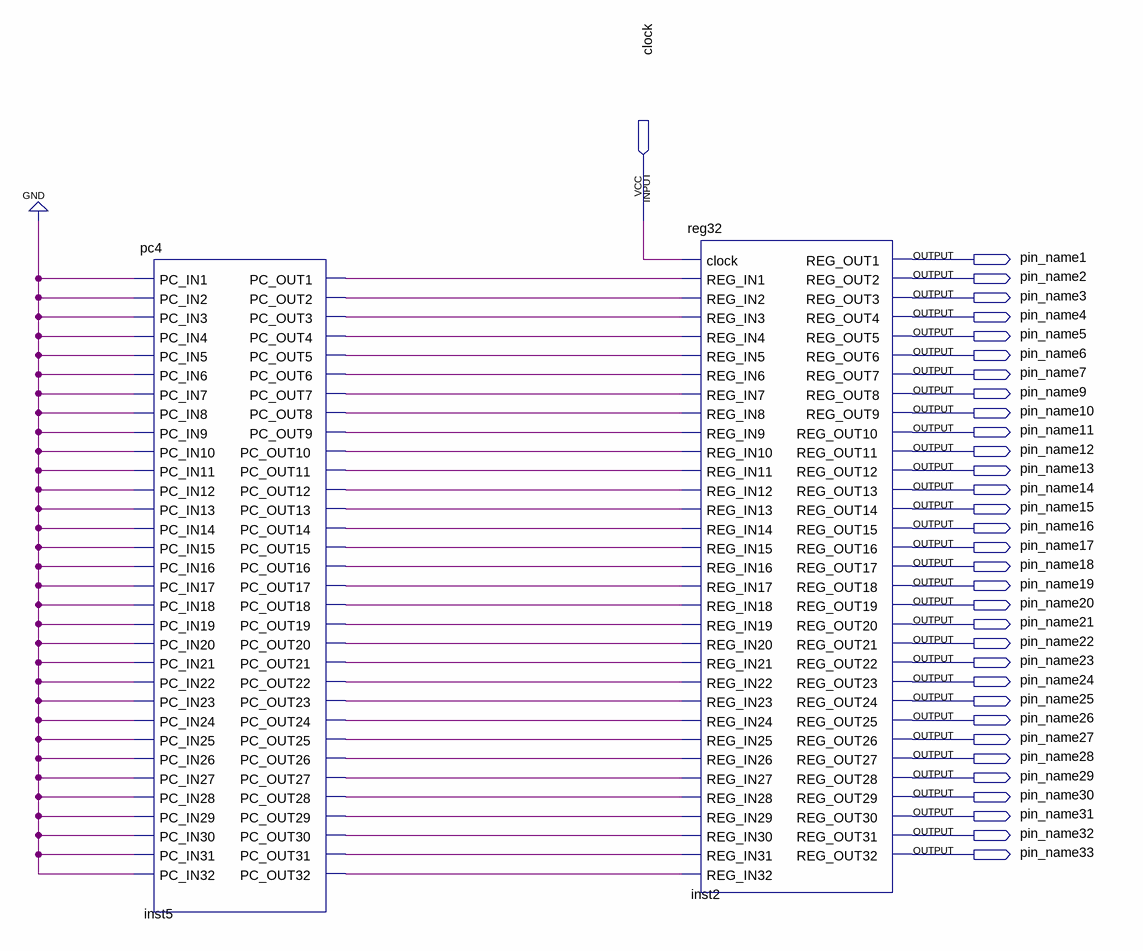
[diagram p0: schematic sheet]
// Quartus schematic Trabalho2.bdf as structural Verilog: 2 symbols, 33 pins
module Trabalho2 (
  input  clock,
  output pin_name1,
  output pin_name2,
  output pin_name3,
  output pin_name4,
  output pin_name5,
  output pin_name6,
  output pin_name7,
  output pin_name9,
  output pin_name10,
  output pin_name11,
  output pin_name12,
  output pin_name13,
  output pin_name14,
  output pin_name15,
  output pin_name16,
  output pin_name17,
  output pin_name18,
  output pin_name19,
  output pin_name20,
  output pin_name21,
  output pin_name22,
  output pin_name23,
  output pin_name24,
  output pin_name25,
  output pin_name26,
  output pin_name27,
  output pin_name28,
  output pin_name29,
  output pin_name30,
  output pin_name31,
  output pin_name32,
  output pin_name33
);

  wire inst5_pc_out1, inst5_pc_out2, inst5_pc_out3, inst5_pc_out4, inst5_pc_out5, inst5_pc_out6,
       inst5_pc_out7, inst5_pc_out8, inst5_pc_out9, inst5_pc_out10, inst5_pc_out11, inst5_pc_out12,
       inst5_pc_out13, inst5_pc_out14, inst5_pc_out15, inst5_pc_out16, inst5_pc_out17, inst5_pc_out18,
       inst5_pc_out19, inst5_pc_out20, inst5_pc_out21, inst5_pc_out22, inst5_pc_out23, inst5_pc_out24,
       inst5_pc_out25, inst5_pc_out26, inst5_pc_out27, inst5_pc_out28, inst5_pc_out29, inst5_pc_out30,
       inst5_pc_out31, inst5_pc_out32;

  pc4 inst5 (
    .PC_IN1(1'b0), .PC_IN2(1'b0), .PC_IN3(1'b0), .PC_IN4(1'b0), .PC_IN5(1'b0), .PC_IN6(1'b0), .PC_IN7(1'b0),
    .PC_IN8(1'b0), .PC_IN9(1'b0), .PC_IN10(1'b0), .PC_IN11(1'b0), .PC_IN12(1'b0), .PC_IN13(1'b0),
    .PC_IN14(1'b0), .PC_IN15(1'b0), .PC_IN16(1'b0), .PC_IN17(1'b0), .PC_IN18(1'b0), .PC_IN19(1'b0),
    .PC_IN20(1'b0), .PC_IN21(1'b0), .PC_IN22(1'b0), .PC_IN23(1'b0), .PC_IN24(1'b0), .PC_IN25(1'b0),
    .PC_IN26(1'b0), .PC_IN27(1'b0), .PC_IN28(1'b0), .PC_IN29(1'b0), .PC_IN30(1'b0), .PC_IN31(1'b0),
    .PC_IN32(1'b0), .PC_OUT1(inst5_pc_out1), .PC_OUT2(inst5_pc_out2), .PC_OUT3(inst5_pc_out3),
    .PC_OUT4(inst5_pc_out4), .PC_OUT5(inst5_pc_out5), .PC_OUT6(inst5_pc_out6), .PC_OUT7(inst5_pc_out7),
    .PC_OUT8(inst5_pc_out8), .PC_OUT9(inst5_pc_out9), .PC_OUT10(inst5_pc_out10), .PC_OUT11(inst5_pc_out11),
    .PC_OUT12(inst5_pc_out12), .PC_OUT13(inst5_pc_out13), .PC_OUT14(inst5_pc_out14),
    .PC_OUT15(inst5_pc_out15), .PC_OUT16(inst5_pc_out16), .PC_OUT17(inst5_pc_out17),
    .PC_OUT18(inst5_pc_out18), .PC_OUT19(inst5_pc_out19), .PC_OUT20(inst5_pc_out20),
    .PC_OUT21(inst5_pc_out21), .PC_OUT22(inst5_pc_out22), .PC_OUT23(inst5_pc_out23),
    .PC_OUT24(inst5_pc_out24), .PC_OUT25(inst5_pc_out25), .PC_OUT26(inst5_pc_out26),
    .PC_OUT27(inst5_pc_out27), .PC_OUT28(inst5_pc_out28), .PC_OUT29(inst5_pc_out29),
    .PC_OUT30(inst5_pc_out30), .PC_OUT31(inst5_pc_out31), .PC_OUT32(inst5_pc_out32));
  reg32 inst2 (
    .clock(clock), .REG_IN1(inst5_pc_out1), .REG_IN2(inst5_pc_out2), .REG_IN3(inst5_pc_out3),
    .REG_IN4(inst5_pc_out4), .REG_IN5(inst5_pc_out5), .REG_IN6(inst5_pc_out6), .REG_IN7(inst5_pc_out7),
    .REG_IN8(inst5_pc_out8), .REG_IN9(inst5_pc_out9), .REG_IN10(inst5_pc_out10), .REG_IN11(inst5_pc_out11),
    .REG_IN12(inst5_pc_out12), .REG_IN13(inst5_pc_out13), .REG_IN14(inst5_pc_out14),
    .REG_IN15(inst5_pc_out15), .REG_IN16(inst5_pc_out16), .REG_IN17(inst5_pc_out17),
    .REG_IN18(inst5_pc_out18), .REG_IN19(inst5_pc_out19), .REG_IN20(inst5_pc_out20),
    .REG_IN21(inst5_pc_out21), .REG_IN22(inst5_pc_out22), .REG_IN23(inst5_pc_out23),
    .REG_IN24(inst5_pc_out24), .REG_IN25(inst5_pc_out25), .REG_IN26(inst5_pc_out26),
    .REG_IN27(inst5_pc_out27), .REG_IN28(inst5_pc_out28), .REG_IN29(inst5_pc_out29),
    .REG_IN30(inst5_pc_out30), .REG_IN31(inst5_pc_out31), .REG_IN32(inst5_pc_out32), .REG_OUT1(pin_name1),
    .REG_OUT2(pin_name2), .REG_OUT3(pin_name3), .REG_OUT4(pin_name4), .REG_OUT5(pin_name5),
    .REG_OUT6(pin_name6), .REG_OUT7(pin_name7), .REG_OUT8(pin_name9), .REG_OUT9(pin_name10),
    .REG_OUT10(pin_name11), .REG_OUT11(pin_name12), .REG_OUT12(pin_name13), .REG_OUT13(pin_name14),
    .REG_OUT14(pin_name15), .REG_OUT15(pin_name16), .REG_OUT16(pin_name17), .REG_OUT17(pin_name18),
    .REG_OUT18(pin_name19), .REG_OUT19(pin_name20), .REG_OUT20(pin_name21), .REG_OUT21(pin_name22),
    .REG_OUT22(pin_name23), .REG_OUT23(pin_name24), .REG_OUT24(pin_name25), .REG_OUT25(pin_name26),
    .REG_OUT26(pin_name27), .REG_OUT27(pin_name28), .REG_OUT28(pin_name29), .REG_OUT29(pin_name30),
    .REG_OUT30(pin_name31), .REG_OUT31(pin_name32), .REG_OUT32(pin_name33));
endmodule
